# Altium schematic sheet LEDs.SchDoc
size A4 portrait
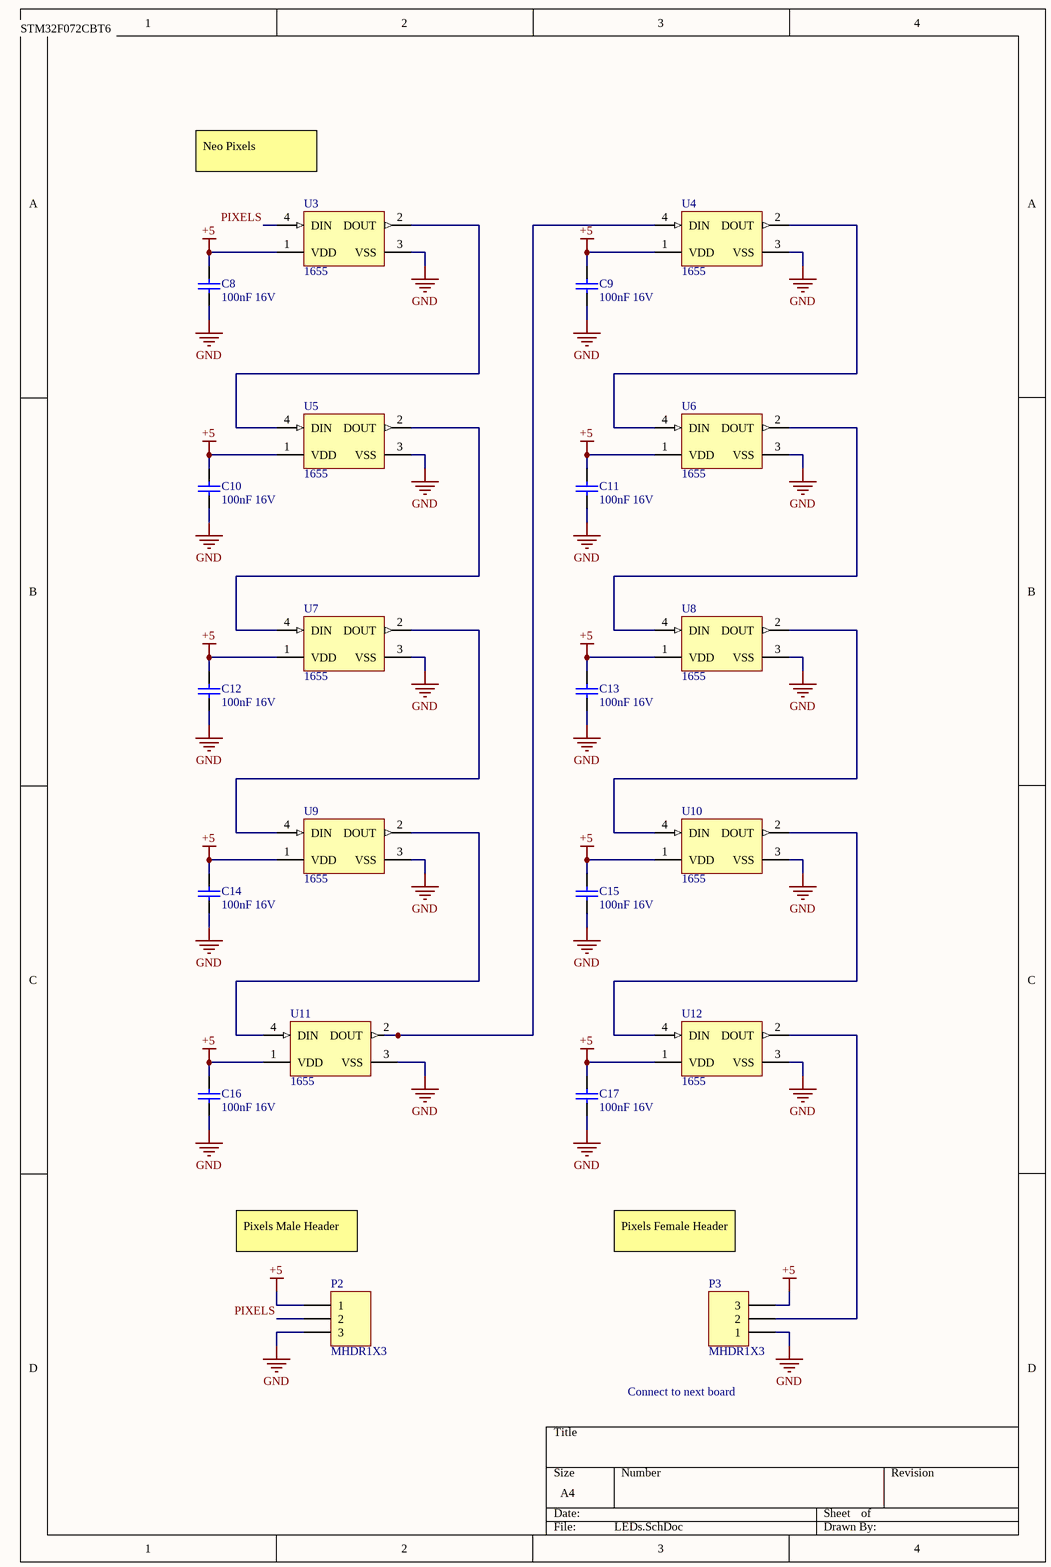
[diagram p0: LEDs.SchDoc]

## Parts
C8  100nF 16V  [CAPC0603(1608)100_N]
C9  100nF 16V  [CAPC0603(1608)100_N]
C10  100nF 16V  [CAPC0603(1608)100_N]
C11  100nF 16V  [CAPC0603(1608)100_N]
C12  100nF 16V  [CAPC0603(1608)100_N]
C13  100nF 16V  [CAPC0603(1608)100_N]
C14  100nF 16V  [CAPC0603(1608)100_N]
C15  100nF 16V  [CAPC0603(1608)100_N]
C16  100nF 16V  [CAPC0603(1608)100_N]
C17  100nF 16V  [CAPC0603(1608)100_N]
P2  MHDR1X3  [MHDR1X3]
P3  MHDR1X3  [MHDR1X3]
U3  1655  [ADA-RGB-1655_V]
U4  1655  [ADA-RGB-1655_V]
U5  1655  [ADA-RGB-1655_V]
U6  1655  [ADA-RGB-1655_V]
U7  1655  [ADA-RGB-1655_V]
U8  1655  [ADA-RGB-1655_V]
U9  1655  [ADA-RGB-1655_V]
U10  1655  [ADA-RGB-1655_V]
U11  1655  [ADA-RGB-1655_V]
U12  1655  [ADA-RGB-1655_V]

## Nets
+5: C8.2 C9.2 C10.2 C11.2 C12.2 C13.2 C14.2 C15.2 C16.2 C17.2 P2.1 P3.3 U3.1(VDD) U4.1(VDD) U5.1(VDD) U6.1(VDD) U7.1(VDD) U8.1(VDD) U9.1(VDD) U10.1(VDD) U11.1(VDD) U12.1(VDD)
GND: C8.1 C9.1 C10.1 C11.1 C12.1 C13.1 C14.1 C15.1 C16.1 C17.1 P2.3 P3.1 U3.3(VSS) U4.3(VSS) U5.3(VSS) U6.3(VSS) U7.3(VSS) U8.3(VSS) U9.3(VSS) U10.3(VSS) U11.3(VSS) U12.3(VSS)
PIXELS: P2.2 U3.4(DIN)
NetP3_2: P3.2 U12.2(DOUT)
NetU3_2: U3.2(DOUT) U5.4(DIN)
NetU4_2: U4.2(DOUT) U6.4(DIN)
NetU4_4: U4.4(DIN) U11.2(DOUT)
NetU5_2: U5.2(DOUT) U7.4(DIN)
NetU6_2: U6.2(DOUT) U8.4(DIN)
NetU7_2: U7.2(DOUT) U9.4(DIN)
NetU8_2: U8.2(DOUT) U10.4(DIN)
NetU9_2: U9.2(DOUT) U11.4(DIN)
NetU10_2: U10.2(DOUT) U12.4(DIN)

## Notes on the sheet
- STM32F072CBT6
- Neo Pixels
- Pixels Male Header
- Pixels Female Header
- Connect to next board

## Library data of the parts
C8-C17 = CMP-1035-02584-1: CAP 100nF 16V ±10% 0603 (1608 Metric) Thickness 1mm SMD; Tolerance: Â±10%; Case-EIA: 0603; Case-Metric: 1608; Technology: SMT; Max Thickness: 1 mm; Value: 100nF; Rated Voltage: 16 V
P2 P3 = MHDR1X3: Header, 3-Pin; LatestRevisionDate: 17-Jul-2002; LatestRevisionNote: Re-released for DXP Platform.; Publisher: Altium Limited
U3-U12 = CMP-2000-05026-1: Intelligent Control LED Integrated Light Source, 3.5 to 5.3 V, -25 to 80 degC, 4-Pin SMD, RoHS, Tape and Reel; Manufacturer: Adafruit-Industries-LLC; Number of LEDs: 10; Configuration: Discrete; Utilized LED: WS2812(5050); Datasheet URL: http://datasheet.octopart.com/ADA1655-Adafruit-Industries-datasheet-32028139.pdf; Series: Neopixel; Interface: -; Package Description: 4-Pin Surface Mount Device, Body 5 x 5 mm; Color: Red,Green,Blue(RGB); Category: Optoelectronics; Controller Type: -; Package Reference: 1655; Manufacturer URL: https://www.adafruit.com/; Mounting Type: SurfaceMount; Datasheet Version: May-13; Size / Dimension: 5.00mmLx5.00mmW; Family: Addressable,Specialty